# EAGLE design uart (EAGLE 9.0.1)
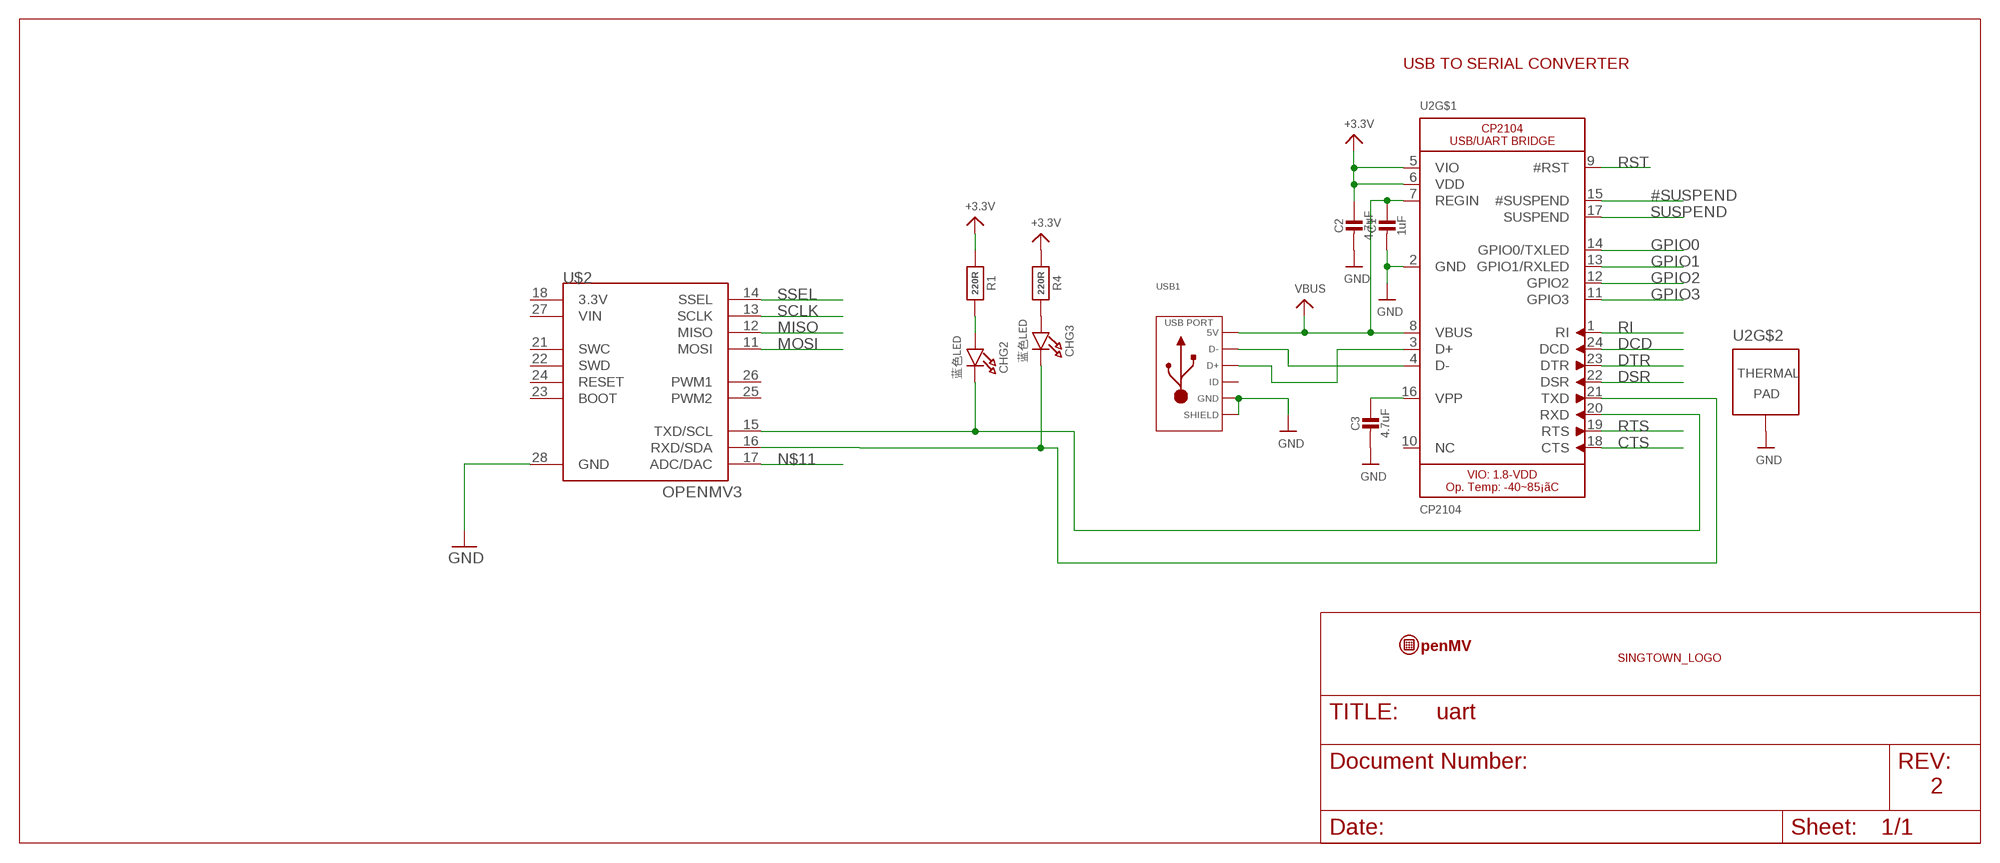
[diagram p0: schematic, sheet 1]

## Parts
C1  1uF  CAP_CERAMIC_0603MP  [_0603MP]
C2  4.7uF  CAP_CERAMIC_0603MP  [_0603MP]
C3  4.7uF  CAP_CERAMIC_0603MP  [_0603MP]
CHG2  蓝色LED  LED0603_NOOUTLINE  [CHIPLED_0603_NOOUTLINE]
CHG3  蓝色LED  LED0603_NOOUTLINE  [CHIPLED_0603_NOOUTLINE]
R1  220R  RESISTOR_0603MP  [_0603MP]
R4  220R  RESISTOR_0603MP  [_0603MP]
U2  CP2104  [QFN24_4MM_SMSC]
U$2  OPENMV3  [OPENMV3]
U$7  OPENMV-LOGO  [OPENMV-LOGO]
U$8  SINGTOWN_LOGO  [SINGTOWN_5MM]
USB1  USB_MICRO_RIGHT  [MICROUSB-RIGHT]

## Nets
3.3V: C2.1 R1.1 R4.1 U2.5(VIO) U2.6(VDD) ; supply symbol labelled +3.3V
#SUSPEND: U2.15(#SUSPEND)
CTS: U2.18(CTS)
DCD: U2.24(DCD)
DSR: U2.22(DSR)
DTR: U2.23(DTR)
GND: C1.2 C2.2 C3.2 U2.2(GND) U2.THERM(TP) U$2.28(GND) USB1.5(GND) USB1.S1(SLD) USB1.S2(SLD) USB1.S3(SLD) USB1.S4(SLD) USB1.S5(SLD) USB1.S6(SLD)
GPIO0: U2.14(GPIO0/TXLED)
GPIO1: U2.13(GPIO1/RXLED)
GPIO2: U2.12(GPIO2)
GPIO3: U2.11(GPIO3)
MISO: U$2.12(MISO)
MOSI: U$2.11(MOSI)
N$5: U2.4(D-) USB1.2(D-)
N$11: U$2.17(ADC/DAC)
N$13: U2.3(D+) USB1.3(D+)
N$14: C3.1 U2.16(VPP)
N$19: CHG3.C U2.21(TXD) U$2.16(RXD/SDA)
N$23: CHG2.A R1.2
N$24: CHG3.A R4.2
N$25: CHG2.C U2.20(RXD) U$2.15(TXD/SCL)
RI: U2.1(RI)
RST: U2.9(#RST)
RTS: U2.19(RTS)
SCLK: U$2.13(SCLK)
SSEL: U$2.14(SSEL)
SUSPEND: U2.17(SUSPEND)
VBUS: C1.1 U2.7(REGIN) U2.8(VBUS) USB1.1(5V)
Unconnected: U2.10(NC) U$2.18(3.3V) U$2.21(SWC) U$2.22(SWD) U$2.23(BOOT) U$2.24(RESET) U$2.25(PWM2) U$2.26(PWM1) U$2.27(VIN) USB1.4(ID)

## Notes on the sheet
- USB TO SERIAL CONVERTER
- 2

## Library data of the parts
C1-C3 = microbuilder:CAP_CERAMIC: Ceramic Capacitors For new designs, use the packages preceded by an '_' character since they are more reliable: The following footprints should be used on most boards: _0402 - Standard footprint for regular board layouts _0603 - Standard footprint for regular board layouts _0805 - Standard footprint for regular board layouts _1206 - Standard footprint for regular board layouts For extremely tight-pitch boards where space is at a premium, the following 'micro-pitch' footprints can be used (smaller pads, no silkscreen outline, etc.): _0402MP - Micro-pitch footprint for very dense/compact boards _0603MP - Micro-pitch footprint for very dense/compact boards _0805MP - Micro-pitch footprint for very dense/compact boards _1206MP - Micro-pitch footprint for very dense/compact boards
CHG2 CHG3 = microbuilder:LED: LED 0603 - 0603 Surface Mount Package 2mA: Green LED - Low Power (3.9mcd, 2ma, 1.7Vf) - Digikey: 475-2709-2-ND Orange LED - Low Power (9.8mcd, 2ma, 1.8Vf) - Digikey: 475-1194-2-ND Red LED - Low Power (5mcd, 2ma, 1.8Vf) - Digikey: 475-1195-2-ND Yellow LED - Low Power (7mcd, 2ma, 1.8Vf) - Digikey: 475-1196-2-ND 5mA: Blue LED - Low Power (17mcd, 5ma, 2.9Vf) - Digikey: LNJ937W8CRACT-ND 0805 - 0805 Surface Mount Package 2mA: Red LED (8.8mcd, 2mA, 1.8Vf, Clear) - Low Power [Digikey: 475-2510-1-ND] Green LED (5mcd, 2mA, 1.8Vf, Clear) - Low Power [Digikey: 475-2730-1-ND] Yellow LED (11.3mcd, 2mA, 1.8Vf, Clear) - Low Power [Digikey: 475-2555-1-ND] 20mA: Red LED (104mcd, 20mA, Diffused) - LS R976 [Digikey: 475-1278-6-ND] Red LED (12mcd, 20mA, 2.0Vf, Clear) - APT2012EC [Digikey: 754-1128-1-ND] Green LED (15mcd, 20mA, 2.2Vf, Clear) - APT2012GC [Digikey: 754-1131-1-ND] Orange LED (160mcd, 20mA, 2.1Vf, Clear) - APT2012SECK [Digikey: 754-1130-1-ND] 1206 - 1206 Surface Mount Package Green LED (26mcd, 20mA, Diffused) - LG N971 [Digikey: 475-1407-6-ND] Red LED (15mcd, 20mA, Diffused) - LH N974 [Digikey: 475-1416-6-ND] Cree - Cree High-Power Surface Mount LEDs XPEBWT-L1-0000-00D50 - White 111lm 350mA 2.9Vf 6200K 110¡ã XTEAWT-00-0000-00000LEE3 - White 114lm 350mA 2.85Vf 5000K 115¡ã Everlight - Everlight 45-21 Series Surface Mount LEDs 45-21/QK2C-B2832AC2CB2/2T - Warm White 2000mcd 20mA 3.25Vf 3050K 120¡ã 45-21/LK2C-B38452C4CB2/2T - Nuetral White 2000mcd 20mA 3.25Vf 4150K 120¡ã 45-21/LK2C-B50634C6CB2/2T - Cold White 2200mcd 20mA 3.25Vf 5650K 120¡ã PLCC2 Reverse Mount LS T77K-J1L2-1-0-2-R18-Z - Red 11.25mcd 2mA 1.8Vf 630nm 120¡ã LO T77K-L1M2-24-Z - Orange 19.6mcd 2mA 1.8Vf 606nm 120¡ã LY T77K-K2M1-26-Z - Yellow 15.7mcd 2mA 1.8Vf 587nm 120¡ã
R1 R4 = microbuilder:RESISTOR: Resistors For new designs, use the packages preceded by an '_' character since they are more reliable: The following footprints should be used on most boards: _0402 - Standard footprint for regular board layouts _0603 - Standard footprint for regular board layouts _0805 - Standard footprint for regular board layouts _1206 - Standard footprint for regular board layouts For extremely tight-pitch boards where space is at a premium, the following 'micro-pitch' footprints can be used (smaller pads, no silkscreen outline, etc.): _0402MP - Micro-pitch footprint for very dense/compact boards _0603MP - Micro-pitch footprint for very dense/compact boards _0805MP - Micro-pitch footprint for very dense/compact boards _1206MP - Micro-pitch footprint for very dense/compact boards
U2 = microbuilder:CP2104: CP2104 - USB to UART Bridge VDD Output: 3.45V
U$2 = openmv:OPENMV3
U$7 = openmv:OPENMV-LOGO
U$8 = singtown:SINGTOWN_LOGO
USB1 = pyboard:USB: Library: MF_Connectors Description: 5 Pin USB Connectors. SLD is the shield connection. Usually tied to ground through a small ferrite bead.

## Net classes
1 vcc: width 1.016 mm, clearance 0.203 mm
2 antenna: width 0.363 mm, clearance 0.305 mm
3 1.8v: width 0.457 mm, clearance 0.254 mm

## Board
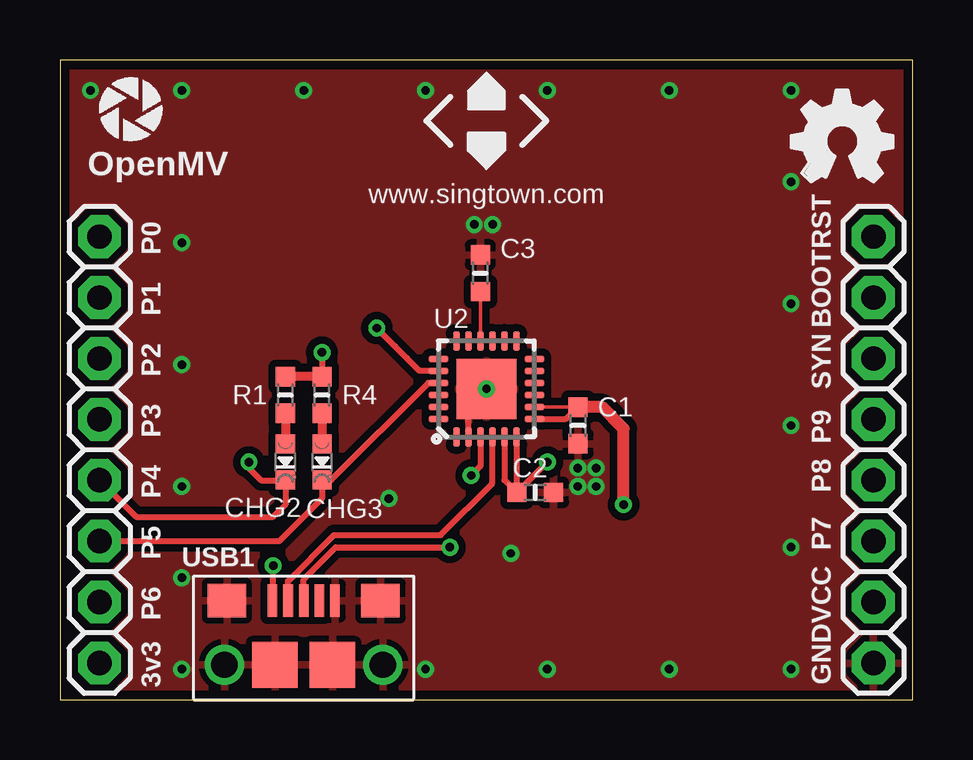
[diagram p1: board, top side]
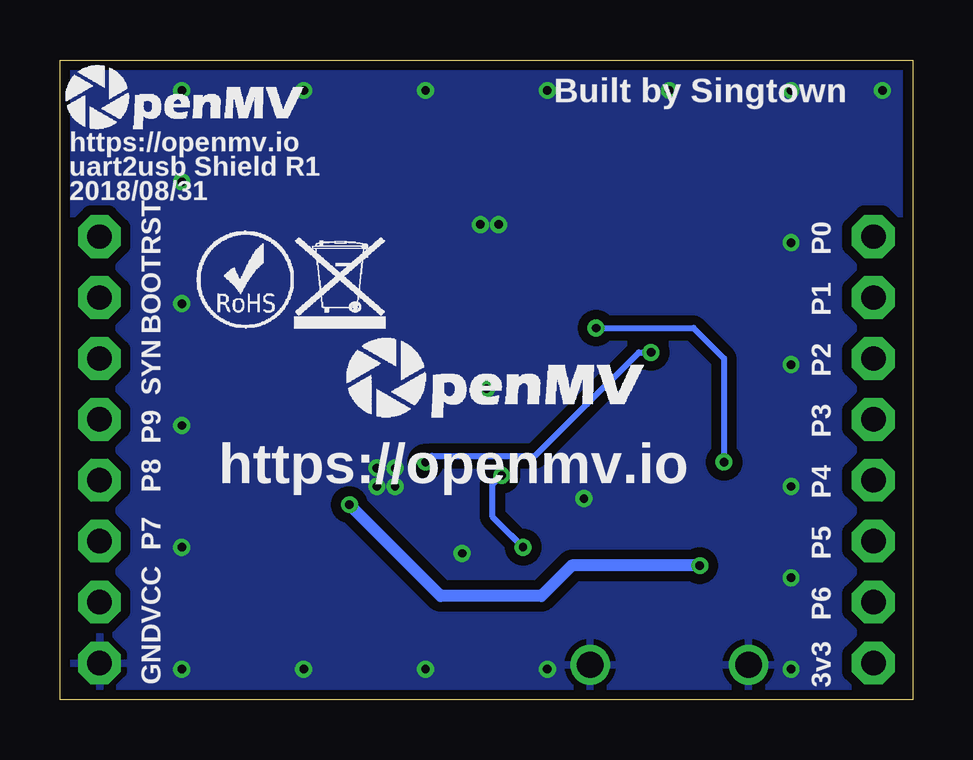
[diagram p2: board, bottom side, seen from below]

Size 35.56 x 26.67 mm. Coordinates in mm from the lower left corner, seen from the top.
Outline: 0,0 35.56,0 35.56,26.67 0,26.67 0,0
Copper layers (1*16): Top 0.0356mm / dielectric 1.5011mm / Bottom 0.0356mm
Design rules "default": minimum track width 6mil, minimum drill 13mil, track to track 6mil, track to pad 6mil, pad to pad 6mil, via to via 6mil, smd to smd 6mil, copper to edge 15mil, drill to drill 6mil, minimum pad ring 7mil, minimum via ring 7mil, stop-mask expansion 3mil, vias tented up to drill 30mil, thermal gap 10mil

### Footprints (pad centres in the part's own frame; a part is rotated, then mirrored left to right if it is on the bottom)
_0603MP = smd 0.8 x 0.8: 1 -0.762,0; 2 0.762,0
CHIPLED_0603_NOOUTLINE = smd 0.8 x 0.8: A 0,-0.75; C 0,0.75
QFN24_4MM_SMSC = smd 0.8 x 0.28: 1 -2,1.25; 2 -2,0.75; 3 -2,0.25; 4 -2,-0.25; 5 -2,-0.75; 6 -2,-1.25; 13 2,-1.25; 14 2,-0.75; 15 2,-0.25; 16 2,0.25; 17 2,0.75; 18 2,1.25 | smd 0.28 x 0.8: 7 -1.25,-2; 8 -0.75,-2; 9 -0.25,-2; 10 0.25,-2; 11 0.75,-2; 12 1.25,-2; 19 1.25,2; 20 0.75,2; 21 0.25,2; 22 -0.25,2; 23 -0.75,2; 24 -1.25,2 | smd 2.5 x 2.5: THERM 0,0
OPENMV3 = drill 1.016 pad 1.778 octagon: 11 1.651,19.304; 12 1.651,16.764; 13 1.651,14.224; 14 1.651,11.684; 15 1.651,9.144; 16 1.651,6.604; 17 1.651,4.064; 18 1.651,1.524; 21 33.909,19.304; 22 33.909,16.764; 23 33.909,14.224; 24 33.909,11.684; 25 33.909,9.144; 26 33.909,6.604; 27 33.909,4.064; 28 33.909,1.524
MICROUSB-RIGHT = smd 0.4 x 1.35: 1 -1.3,1.27; 2 -0.65,1.27; 3 0,1.27; 4 0.65,1.27; 5 1.3,1.27 | drill 1.1: S1 -3.3,-1.405; S2 3.3,-1.405 | smd 1.6 x 1.4: S3 -3.2,1.27; S4 3.2,1.27 | smd 1.9 x 1.9: S5 -1.2,-1.405; S6 1.2,-1.405

### Placement (x,y rotation side)
C1  21.59,11.43 270 top
C2  19.81,8.64 0 top
C3  17.53,17.78 90 top
CHG2  9.4,9.91 180 top
CHG3  10.92,9.91 180 top
R1  9.4,12.7 270 top
R4  10.92,12.7 270 top
U2  17.78,12.95 90 top
U$1  [OSHW_FILLX150_NOTEXT]  30.48,21.59 0 top
U$2  0,0 0 top
U$7  1.52,23.11 0 top
U$8  17.78,24.13 0 top
U$13  [OMV-LOGO-SMALL]  35.43,23.62 0 bottom
U$14  [ROHS]  29.84,15.49 0 bottom
U$15  [WEEE]  25.78,15.49 0 bottom
U$16  [OMV-LOGO]  23.75,11.56 0 bottom
USB1  10.16,2.86 0 top

### Tracks (layer width: path | path; a pad name or v marks a point on that pad's centre or on a via)
3.3V  (via drill 0.35)
  Top 0.254: v10.92,14.48 R4.1 | v20.32,9.91 C2.1 | U2.6 19.03,8.66 C2.1 | U2.5 18.53,9.16 C2.1
  Top 0.381: R4.1 R1.1
  Bottom 0.254: v10.92,14.48 11.43,14.48 13.59,12.32 15.75,10.16 20.07,10.16 v20.32,9.91
GND  (via drill 0.35)
  Top 0.254: U2.2 17.03,12.2 U2.THERM
  other vias: 17.78,12.95 18.8,6.1 13.72,8.38 18.03,19.81 17.27,19.81 21.59,9.65 22.35,9.65 22.35,8.89 21.59,8.89 1.27,25.4 5.08,19.05 5.08,13.97 5.08,8.89 5.08,5.08 5.08,1.27 15.24,1.27 20.32,1.27 25.4,1.27 30.48,1.27 30.48,6.35 30.48,11.43 30.48,16.51 30.48,21.59 30.48,25.4 25.4,25.4 20.32,25.4 15.24,25.4 10.16,25.4 5.08,25.4
  pour Bottom (isolate 0.406, rank 2): 0,0 35.56,0 35.56,26.67 0,26.67
  pour Top (isolate 0.305, rank 2): 0,0 35.56,0 35.56,26.67 0,26.67
N$5
  Top 0.254: USB1.2 9.51,4.94 11.43,6.86 15.87,6.86 18.03,9.02 U2.4
N$13  (via drill 0.35)
  Top 0.254: USB1.3 10.16,5.01 10.19,5.05 11.5,6.35 v16.26,6.35 | U2.3 17.53,9.73 v17.14,9.35
  Bottom 0.254: 16.76,6.86 v16.26,6.35 17.53,7.62 17.53,8.96 v17.14,9.35
N$14
  Top 0.152: C3.1 U2.16
N$19
  Top 0.254: U$2.16 9.14,6.6 10.92,8.38 CHG3.C 11.31,9.16 15.36,13.2 U2.21
N$23
  Top 0.254: CHG2.A
  Top 0.381: R1.2 CHG2.A
N$24
  Top 0.254: CHG3.A
  Top 0.381: R4.2 CHG3.A
N$25  (via drill 0.35)
  Top 0.152: 9.39,9.14 CHG2.C
  Top 0.254: U2.20 15,13.7 14.48,14.22 | v7.87,9.91 7.87,9.65 8.38,9.14 9.39,9.14 CHG2.C 9.4,8.13 8.89,7.62 3.17,7.62 U$2.15 | 14.48,14.22 13.97,14.73 v13.21,15.49 14.48,14.22
  Bottom 0.254: v13.21,15.49 9.14,15.49 7.87,14.22 v7.87,9.91
VBUS  (via drill 0.35)
  Top 0.152: C1.1 19.79,12.19 U2.8
  Top 0.254: U2.7 21.1,11.7 C1.1 | USB1.1 8.89,4.16 v8.89,5.59
  Top 0.508: v23.5,8.13 23.5,11.3 22.61,12.19 C1.1
  Bottom 0.508: v8.89,5.59 14.22,5.59 15.49,4.32 19.69,4.32 v23.5,8.13

### Text on the board
tPlace: OpenMV | www.singtown.com | P0 | RST | P1 | BOOT | P2 | SYN | P3 | P9 | P8 | P4 | P5 | P7 | P6 | VCC | 3v3 | GND
bPlace: Built by Singtown | https://openmv.io | uart2usb Shield R1 | 2018/08/31 | P0 | RST | P1 | BOOT | P2 | SYN | P3 | P9 | https://openmv.io | P8 | P4 | P5 | P7 | P6 | VCC | 3v3 | GND